# EasyEDA schematic 1-Schematic_PADAUK Programmer.json
TITLE: PFS154 programmer; REV: 1.0; Date: 2019-02-12; Sheet: 1/1; Drawn By: socram8888; Company: orca.pet
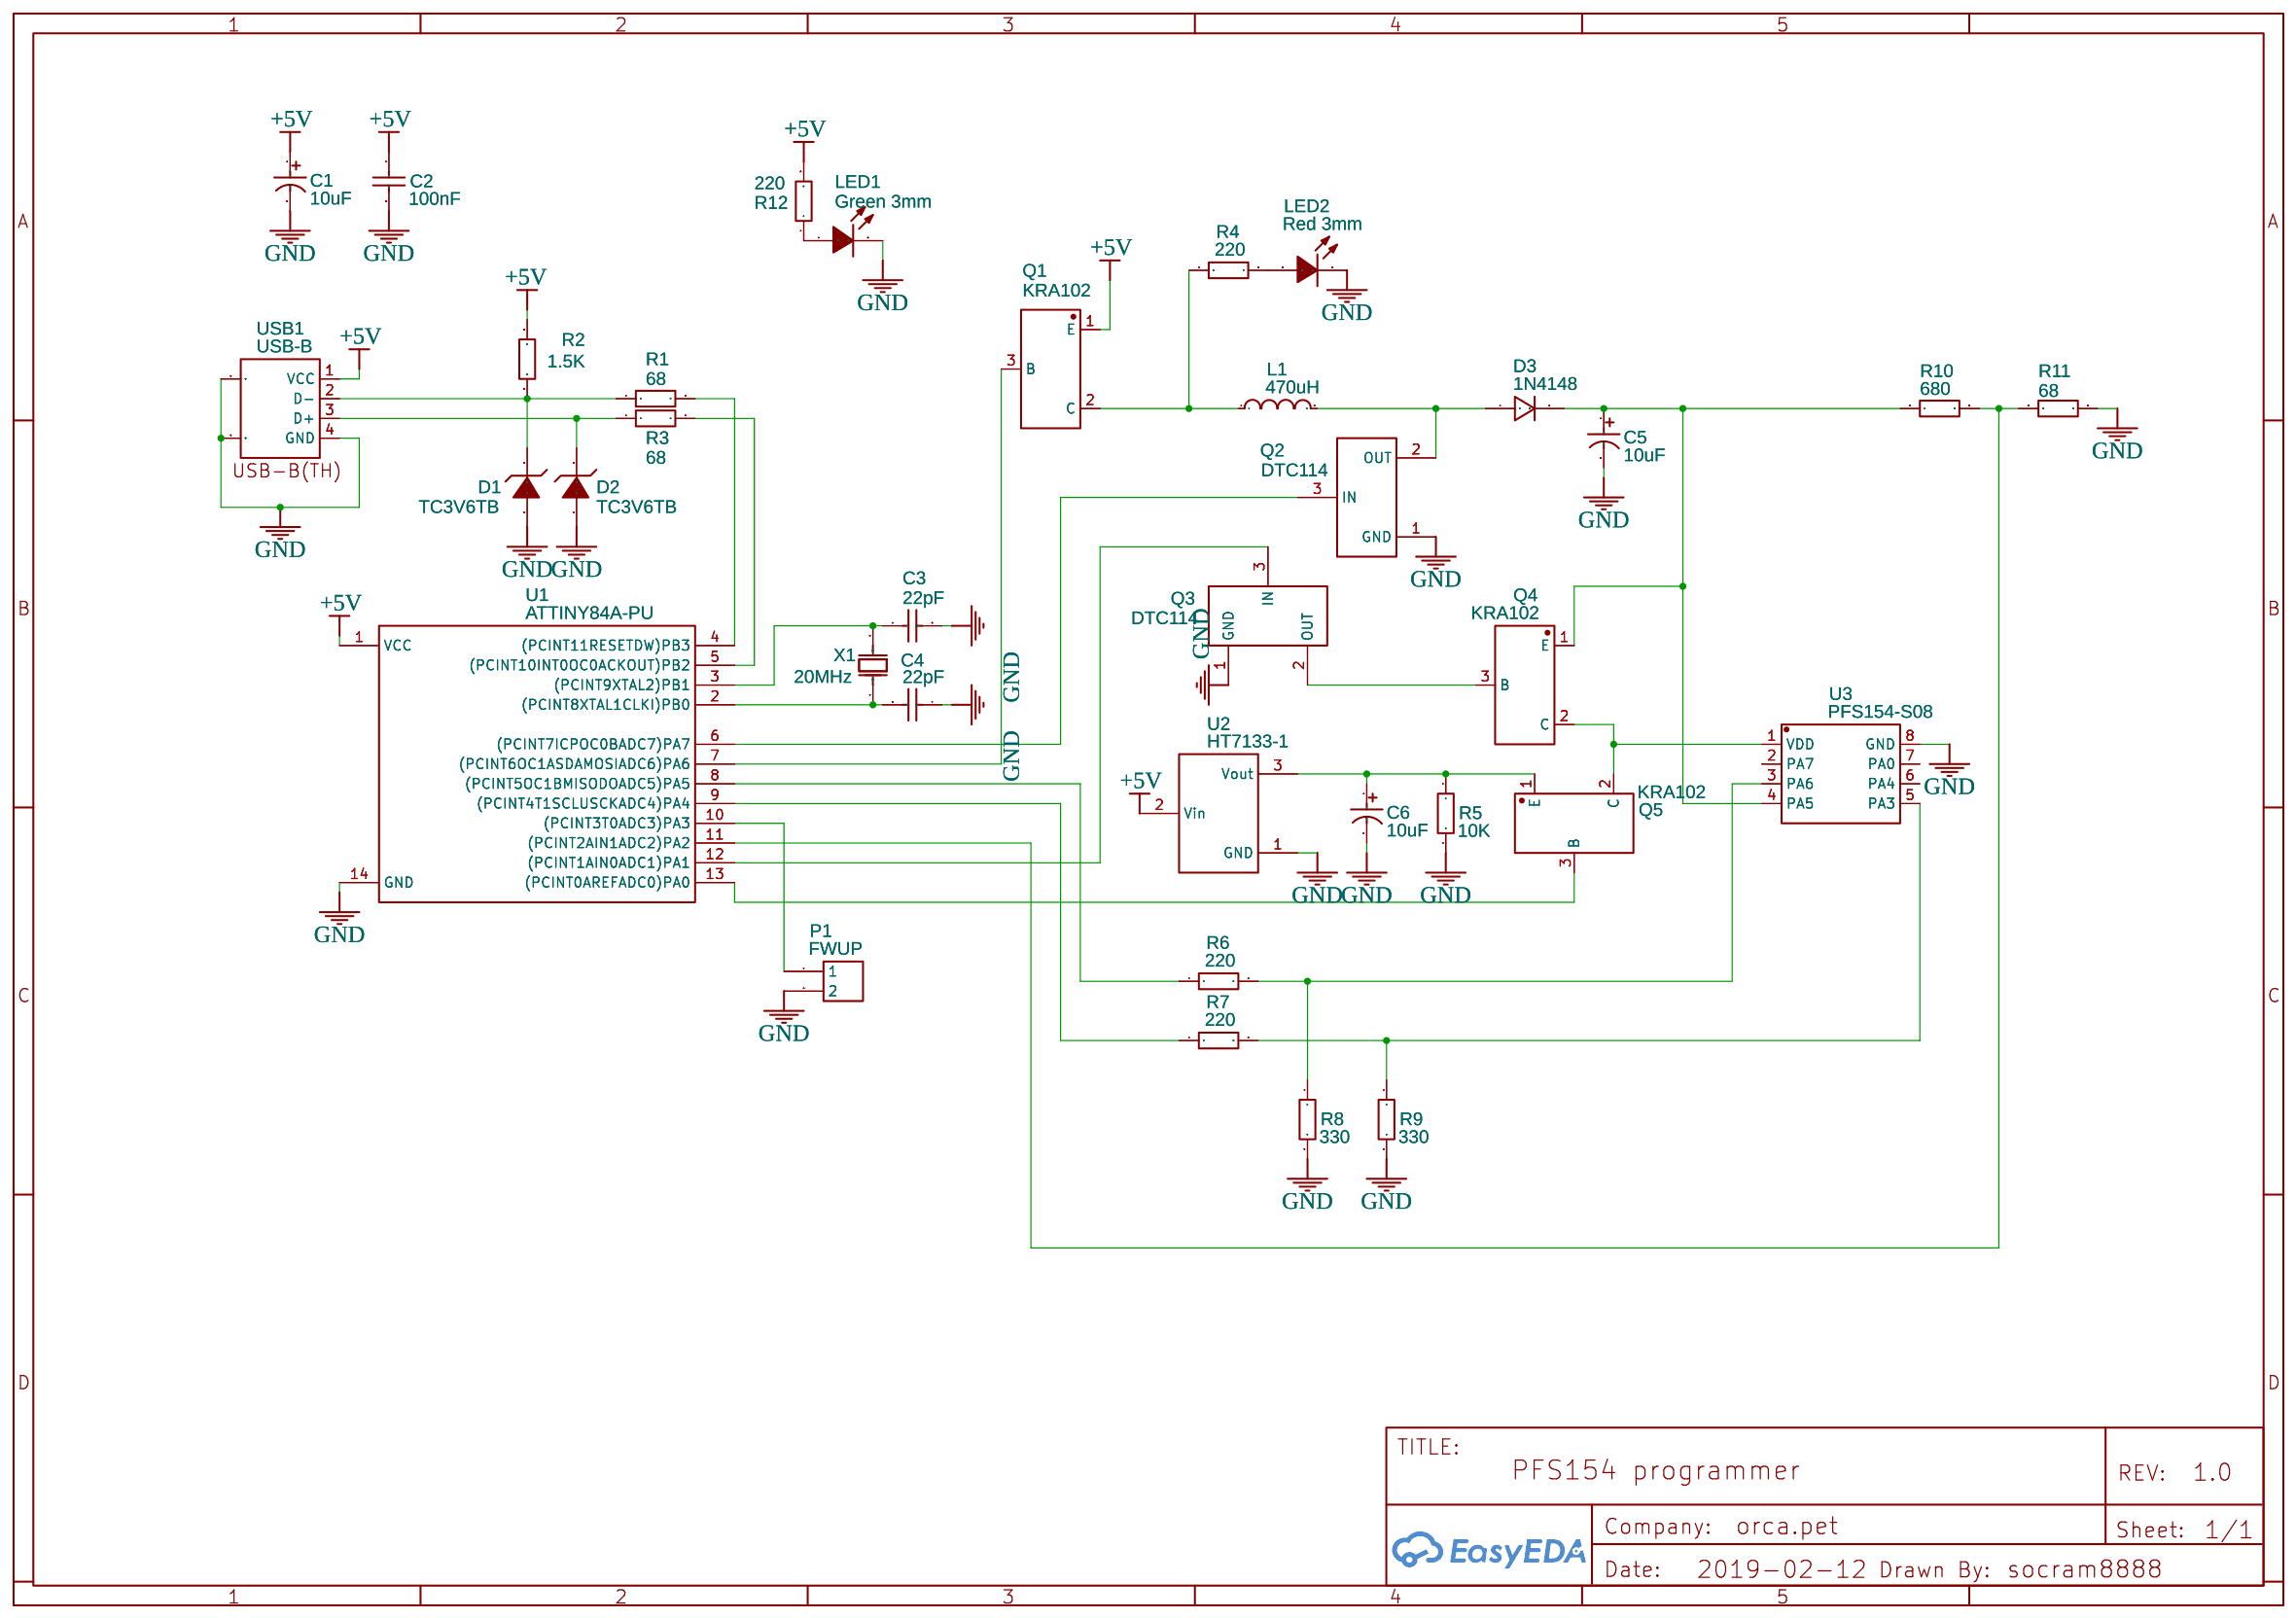
[diagram p0: schematic sheet]

## Parts
C1  10uF  [CAP-D4.0XF1.5]
C2  100nF  [CAP-0.2]
C3  22pF  [RAD-0.1]
C4  22pF  [RAD-0.1]
C5  10uF  [CAP-D4.0XF1.5]
C6  10uF  [CAP-D4.0XF1.5]
D1  TC3V6TB  [DO-35G]
D2  TC3V6TB  [DO-35G]
D3  1N4148  [DO-35G]
L1  470uH  [IND-VL0810]
LED1  Green 3mm  [LED-3MM]
LED2  Red 3mm  [LED-3MM]
P1  FWUP  [HDR-2X1/2.54]
Q1  KRA102  [TO-92(TO-92-3)-2.54]
Q2  DTC114  [TO-92(TO-92-3)-2.54]
Q3  DTC114  [TO-92(TO-92-3)-2.54]
Q4  KRA102  [TO-92(TO-92-3)-2.54]
Q5  KRA102  [TO-92(TO-92-3)-2.54]
R1  68  [AXIAL-0.3]
R2  1.5K  [AXIAL-0.3]
R3  68  [AXIAL-0.3]
R4  220  [AXIAL-0.3]
R5  10K  [AXIAL-0.3]
R6  220  [AXIAL-0.3]
R7  220  [AXIAL-0.3]
R8  330  [AXIAL-0.3]
R9  330  [AXIAL-0.3]
R10  680  [AXIAL-0.3]
R11  68  [AXIAL-0.3]
R12  220  [AXIAL-0.3]
U1  ATTINY84A-PU  [DIP-14]
U2  HT7133-1  [TO-92(TO-92-3)-2.54]
U3  PFS154-S08  [PDIP-8_8PIN-LS7.62-L9.83-W6.60-PITCH2.54-BL]
USB1  USB-B  [USB-M-49]
X1  20MHz  [OSC-49S-1]

## Library data of the parts
C1 C5 C6 = 10uF 25V 4*7: Supplier: LCSC; Manufacturer: ValuePro; Supplier Part: C43351
C2 = C322C104K2R5TA7301: Supplier: LCSC; Supplier Part: C236030; Manufacturer: KEMET; Contributor: LCSC
C3 C4 = 22pf/50V 10%: Supplier: LCSC; Manufacturer: ReliaPro; Supplier Part: C9316
D1 D2 = -: Supplier: LCSC; Supplier Part: C261195; Manufacturer: Tak Cheong; Contributor: LCSC
D3 = -: Supplier Part: C163750; Supplier: LCSC; Manufacturer: FMS; Contributor: LCSC
L1 = VLU0810-471K: Supplier: LCSC; Manufacturer: FH; Supplier Part: C72619
LED1 LED2 = -: Supplier: LCSC; Manufacturer: KENTO; Manufacturer Part: LEDOrange orange 3AO4UD; image: //image.lceda.cn/szlcsc/C62095.jpg; Supplier Part: C62095
P1 = -: Supplier: LCSC; Manufacturer: ReliaPro; Manufacturer Part: 2.54mm 1*2P; image: http://image.lceda.cn/szlcsc/C36717.jpg; Supplier Part: C36717
Q1 Q4 Q5 = -: Supplier: LCSC; Manufacturer: KEC; Manufacturer Part: KRA102-AT/P; Contributor: LCSC; Supplier Part: C147284
Q2 Q3 = -: Supplier: LCSC; Manufacturer: UTC; Manufacturer Part: DTC114EL-T92-K; Contributor: LCSC; Supplier Part: C171504
R1 R3 R11 = MFR-25FTE52-68R: Supplier: LCSC; Supplier Part: C173041; Manufacturer: YAGEO; Contributor: LCSC
R2 = MF1/8W-1.5KΩ±1% T52: Supplier: LCSC; Manufacturer: CCO; Supplier Part: C119183
R4 R6 R7 R12 = MF1/8W ±1% 220Ω OTB5: Supplier: LCSC; Supplier Part: C337127; Manufacturer: FlyWin; Contributor: LCSC
R5 = MF1/4W-10KΩ±1% T52: Supplier: LCSC; Supplier Part: C119347; Manufacturer: Chian Chia Elec; Contributor: LCSC
R8 R9 = MFR0W8F3300A50: Supplier: LCSC; Supplier Part: C81959; Manufacturer: Uniroyal Elec; Contributor: LCSC
R10 = MFR-25FTE52-680K: Supplier: LCSC; Supplier Part: C173038; Manufacturer: YAGEO; Contributor: LCSC
U1 = -: Supplier: LCSC; Manufacturer: MICROCHIP; Contributor: LCSC; Supplier Part: C145560
U2 = -: Supplier: LCSC; Manufacturer: HOLTEK; image: //image.lceda.cn/szlcsc/C73730.jpg; Supplier Part: C73730
U3 = -: Supplier: LCSC; Supplier Part: C317611; Manufacturer: PADAUK Tech; Contributor: LCSC
USB1 = -: Supplier: LCSC; Manufacturer Part: USB-B-Female-90-TH; image: //image.lceda.cn/szlcsc/C46393.jpg; Supplier Part: C46393
X1 = X49SD20MPB2SC: Supplier: LCSC; Manufacturer: YXC; Supplier Part: C21499

## Nets
+5V: C1.1 C2.1 Q1.1(E) R2.1 R12.2 U1.1(VCC) U2.2(Vin) USB1.1(VCC)
GND: C1.2 C2.2 C3.2 C4.1 C5.2 C6.2 D1.1(A) D2.1(A) LED1.2(K) LED2.2(K) P1.2 Q2.1(GND) Q3.1(GND) R5.2 R8.2 R9.2 R11.2 U1.14(GND) U2.1(GND) U3.8(GND) USB1.0 USB1.4(GND)
D3_1: D3.1 L1.2 Q2.2(OUT)
D3_2: C5.1 D3.2 Q4.1(E) R10.1 U3.4(PA5)
LED1_1: LED1.1(A) R12.1
Q4_2: Q4.2(C) Q5.2(C) U3.1(VDD)
Q4_3: Q3.2(OUT) Q4.3(B)
R4_1: L1.1 Q1.2(C) R4.1
R4_2: LED2.1(A) R4.2
R6_2: R6.2 R8.1 U3.3(PA6)
R7_2: R7.2 R9.1 U3.5(PA3)
U1_2: C4.2 U1.2((PCINT8XTAL1CLKI)PB0) X1.1(OSC1)
U1_3: C3.1 U1.3((PCINT9XTAL2)PB1) X1.2(OSC2)
U1_4: R1.2 U1.4((PCINT11RESETDW)PB3)
U1_5: R3.2 U1.5((PCINT10INT0OC0ACKOUT)PB2)
U1_6: Q2.3(IN) U1.6((PCINT7ICPOC0BADC7)PA7)
U1_7: Q1.3(B) U1.7((PCINT6OC1ASDAMOSIADC6)PA6)
U1_8: R6.1 U1.8((PCINT5OC1BMISODOADC5)PA5)
U1_9: R7.1 U1.9((PCINT4T1SCLUSCKADC4)PA4)
U1_10: P1.1 U1.10((PCINT3T0ADC3)PA3)
U1_11: R10.2 R11.1 U1.11((PCINT2AIN1ADC2)PA2)
U1_12: Q3.3(IN) U1.12((PCINT1AIN0ADC1)PA1)
U1_13: Q5.3(B) U1.13((PCINT0AREFADC0)PA0)
U2_3: C6.1 Q5.1(E) R5.1 U2.3(Vout)
USB1_2: D1.2(K) R1.1 R2.2 USB1.2(D-)
USB1_3: D2.2(K) R3.1 USB1.3(D+)

Not connected (* = marked no-connect by the designer): U3 2(PA7) 6(PA4) 7(PA0)
